# EAGLE design iPod_BoB (EAGLE 7.1.0)
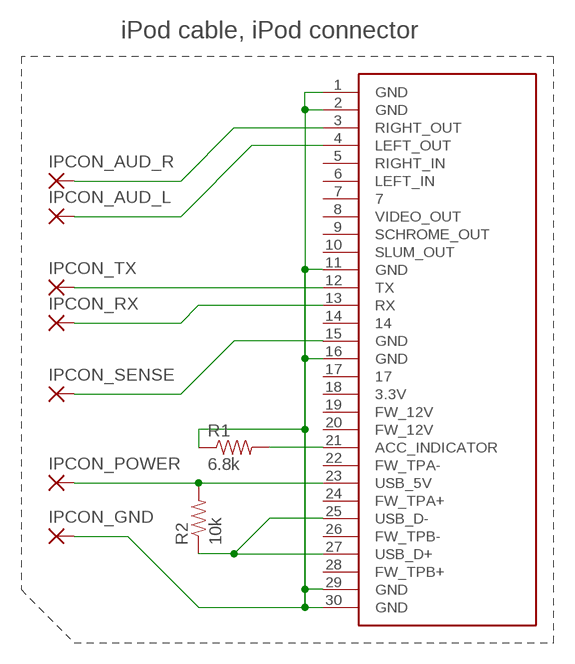
[diagram p0: schematic, sheet 1]

## Parts
IPCON_AUD_L  1,6/0,9  [1,6/0,9]
IPCON_AUD_R  1,6/0,9  [1,6/0,9]
IPCON_GND  1,6/0,9  [1,6/0,9]
IPCON_POWER  1,6/0,9  [1,6/0,9]
IPCON_RX  1,6/0,9  [1,6/0,9]
IPCON_SENSE  1,6/0,9  [1,6/0,9]
IPCON_TX  1,6/0,9  [1,6/0,9]
R1  6.8k  RESISTOR0603-RES  [0603-RES]
R2  10k  RESISTOR0603-RES  [0603-RES]
U$1  IPOD_CONNECTOR_MALE  [IPOD_MALE_CONNECTOR]

## Nets
IP_GND: IPCON_GND.1(P) R1.1 U$1.1(GND) U$1.2(GND) U$1.11(GND) U$1.16(GND) U$1.29(GND) U$1.30(GND)
N$4: IPCON_POWER.1(P) R2.2 U$1.23(USB_5V)
N$6: IPCON_SENSE.1(P) U$1.15(GND)
N$7: IPCON_RX.1(P) U$1.13(RX)
N$8: IPCON_TX.1(P) U$1.12(TX)
N$9: IPCON_AUD_R.1(P) U$1.3(RIGHT_OUT)
N$10: IPCON_AUD_L.1(P) U$1.4(LEFT_OUT)
N$11: R2.1 U$1.25(USB_D-) U$1.27(USB_D+)
N$13: R1.2 U$1.21(ACC_INDICATOR)
Unconnected: U$1.5(RIGHT_IN) U$1.6(LEFT_IN) U$1.7 U$1.8(VIDEO_OUT) U$1.9(SCHROME_OUT) U$1.10(SLUM_OUT) U$1.14 U$1.17 U$1.18(3.3V) U$1.19(FW_12V) U$1.20(FW_12V) U$1.22(FW_TPA-) U$1.24(FW_TPA+) U$1.26(FW_TPB-) U$1.28(FW_TPB+)

## Notes on the sheet
- iPod cable, iPod connector

## Library data of the parts
IPCON_AUD_L IPCON_AUD_R IPCON_GND IPCON_POWER IPCON_RX IPCON_SENSE IPCON_TX = wirepad:1,6/0,9: THROUGH-HOLE PAD
R1 R2 = SparkFun-Resistors:RESISTOR: Resistor Basic schematic elements and footprints for 0603, 1206, and PTH resistors.
U$1 = SparkFun:IPOD_CONNECTOR_MALE: iPod Male Connector This is the connector that will insert into an iPods. Use this connector to gain access to the various iPod pins. Schematic and footprint are not yet production proven. The PCB thickness must be more thin than the standard 0.062" FR4. Spark Fun Electronics SKU : DEV-00633

## Board
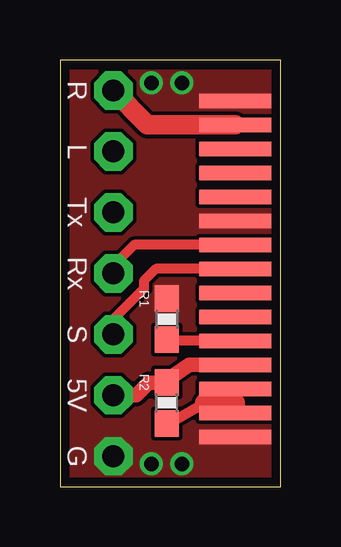
[diagram p1: board, top side]
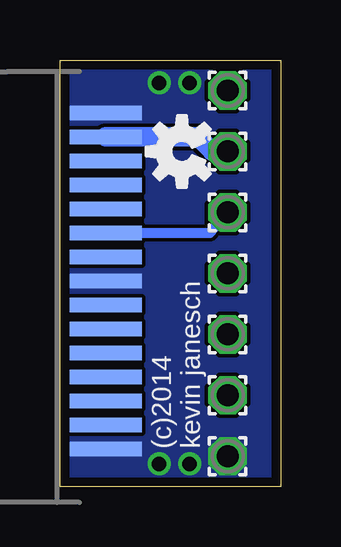
[diagram p2: board, bottom side, seen from below]

Size 9.21 x 17.78 mm. Coordinates in mm from the lower left corner, seen from the top.
Outline: 9.21,17.78 0,17.78 0,0 9.21,0 9.21,17.78
Copper layers (1*16): Top 0.0356mm / dielectric 1.5011mm / Bottom 0.0356mm
Design rules "LaenPCBOrder": minimum track width 6mil, minimum drill 13mil, track to track 6mil, track to pad 6mil, pad to pad 6mil, via to via 6mil, smd to smd 6mil, copper to edge 15mil, drill to drill 6mil, minimum pad ring 7mil, minimum via ring 7mil, stop-mask expansion 3mil, vias tented up to drill 0mil, thermal gap 10mil

### Footprints (pad centres in the part's own frame; a part is rotated, then mirrored left to right if it is on the bottom)
1,6/0,9 = drill 0.914 pad 1.6 octagon: 1 0,0
0603-RES = smd 1.1 x 1: 1 -0.85,0; 2 0.85,0
IPOD_MALE_CONNECTOR = smd 0.6 x 3 bottom: 1 7.5,0; 3 6.5,0; 5 5.5,0; 7 4.5,0; 9 3.5,0; 11 2.5,0; 13 1.5,0; 15 0.5,0; 17 -0.5,0; 19 -1.5,0; 21 -2.5,0; 23 -3.5,0; 25 -4.5,0; 27 -5.5,0; 29 -6.5,0 | smd 0.6 x 3: 2 7,0; 4 6,0; 6 5,0; 8 4,0; 10 3,0; 12 2,0; 14 1,0; 16 0,0; 18 -1,0; 20 -2,0; 22 -3,0; 24 -4,0; 26 -5,0; 28 -6,0; 30 -7,0

### Placement (x,y rotation side)
IPCON_AUD_L  2.22,13.97 0 bottom
IPCON_AUD_R  2.22,16.51 0 bottom
IPCON_GND  2.22,1.27 0 bottom
IPCON_POWER  2.22,3.81 0 bottom
IPCON_RX  2.22,8.89 0 bottom
IPCON_SENSE  2.22,6.35 0 bottom
IPCON_TX  2.22,11.43 0 bottom
R1  4.45,6.99 270 top
R2  4.45,3.49 90 top
U$1  7.3,8.57 90 bottom
U$2  [OSHW-LOGO-S]  4.13,13.97 90 bottom

### Tracks (layer width: path | path; a pad name or v marks a point on that pad's centre or on a via)
IP_GND  (via drill 0.6)
  other vias: 5.08,16.83 5.08,0.95 3.81,0.95 3.81,16.83
  pour Top (no thermals): 0,17.78 0,0 9.21,0 9.21,17.78
  pour Bottom (no thermals): 0,17.78 0,0 9.21,0 9.21,17.78
N$4
  Top 0.61: U$1.23 5.39,5.07 4.45,4.45 4.55,4.45 R2.2 3.71,4.34 3.17,3.81 IPCON_POWER.1
N$6
  Top 0.406: U$1.15 3.99,9.07 3.49,8.57 3.49,8.26 2.22,6.99 IPCON_SENSE.1
N$7
  Top 0.406: U$1.13 3.09,10.07 2.22,9.21 IPCON_RX.1
N$8
  Bottom 0.406: U$1.12 2.95,10.57 IPCON_TX.1
N$9
  Top 0.813: IPCON_AUD_R.1 3.64,15.07 U$1.3
N$10
  Bottom 0.813: U$1.4 3.46,14.57 2.86,13.97 IPCON_AUD_L.1
N$11
  Top 0.406: R2.1 4.55,2.64 6.03,3.49
  Top 0.61: U$1.25 7.3,3.49 U$1.27
  Top 0.813: 6.03,3.49 7.3,3.49
N$13
  Top 0.406: U$1.21 4.54,6.07 R1.2

### Text on the board
tNames: R | L | Tx | Rx | S | 5V | G
bNames: (c)2014 / kevin janesch